# Altium schematic sheet 01_MAIN.SchDoc: =GlobalProjectName
size 594 x 420 mm; CheckedBy: A_D; Author: A_D; SheetTotal: 1; PageSetup: Record=PageOptions|CenterHorizontal=True|CenterVertical=True|PrintScale=0.70|XCorrection=1.00|YCorrection=1.00|PrintKind=2|BorderSize=5000000|LeftOffset=9000|BottomOffset=10100|Orientation=2|PaperLength=11176|PaperWidth=8636|Scale=100|PaperSource=259|PrintQuality=-3|MediaType=1|DitherType=10|PrintScaleMode=1|PaperKind=A3|PaperIndex=8
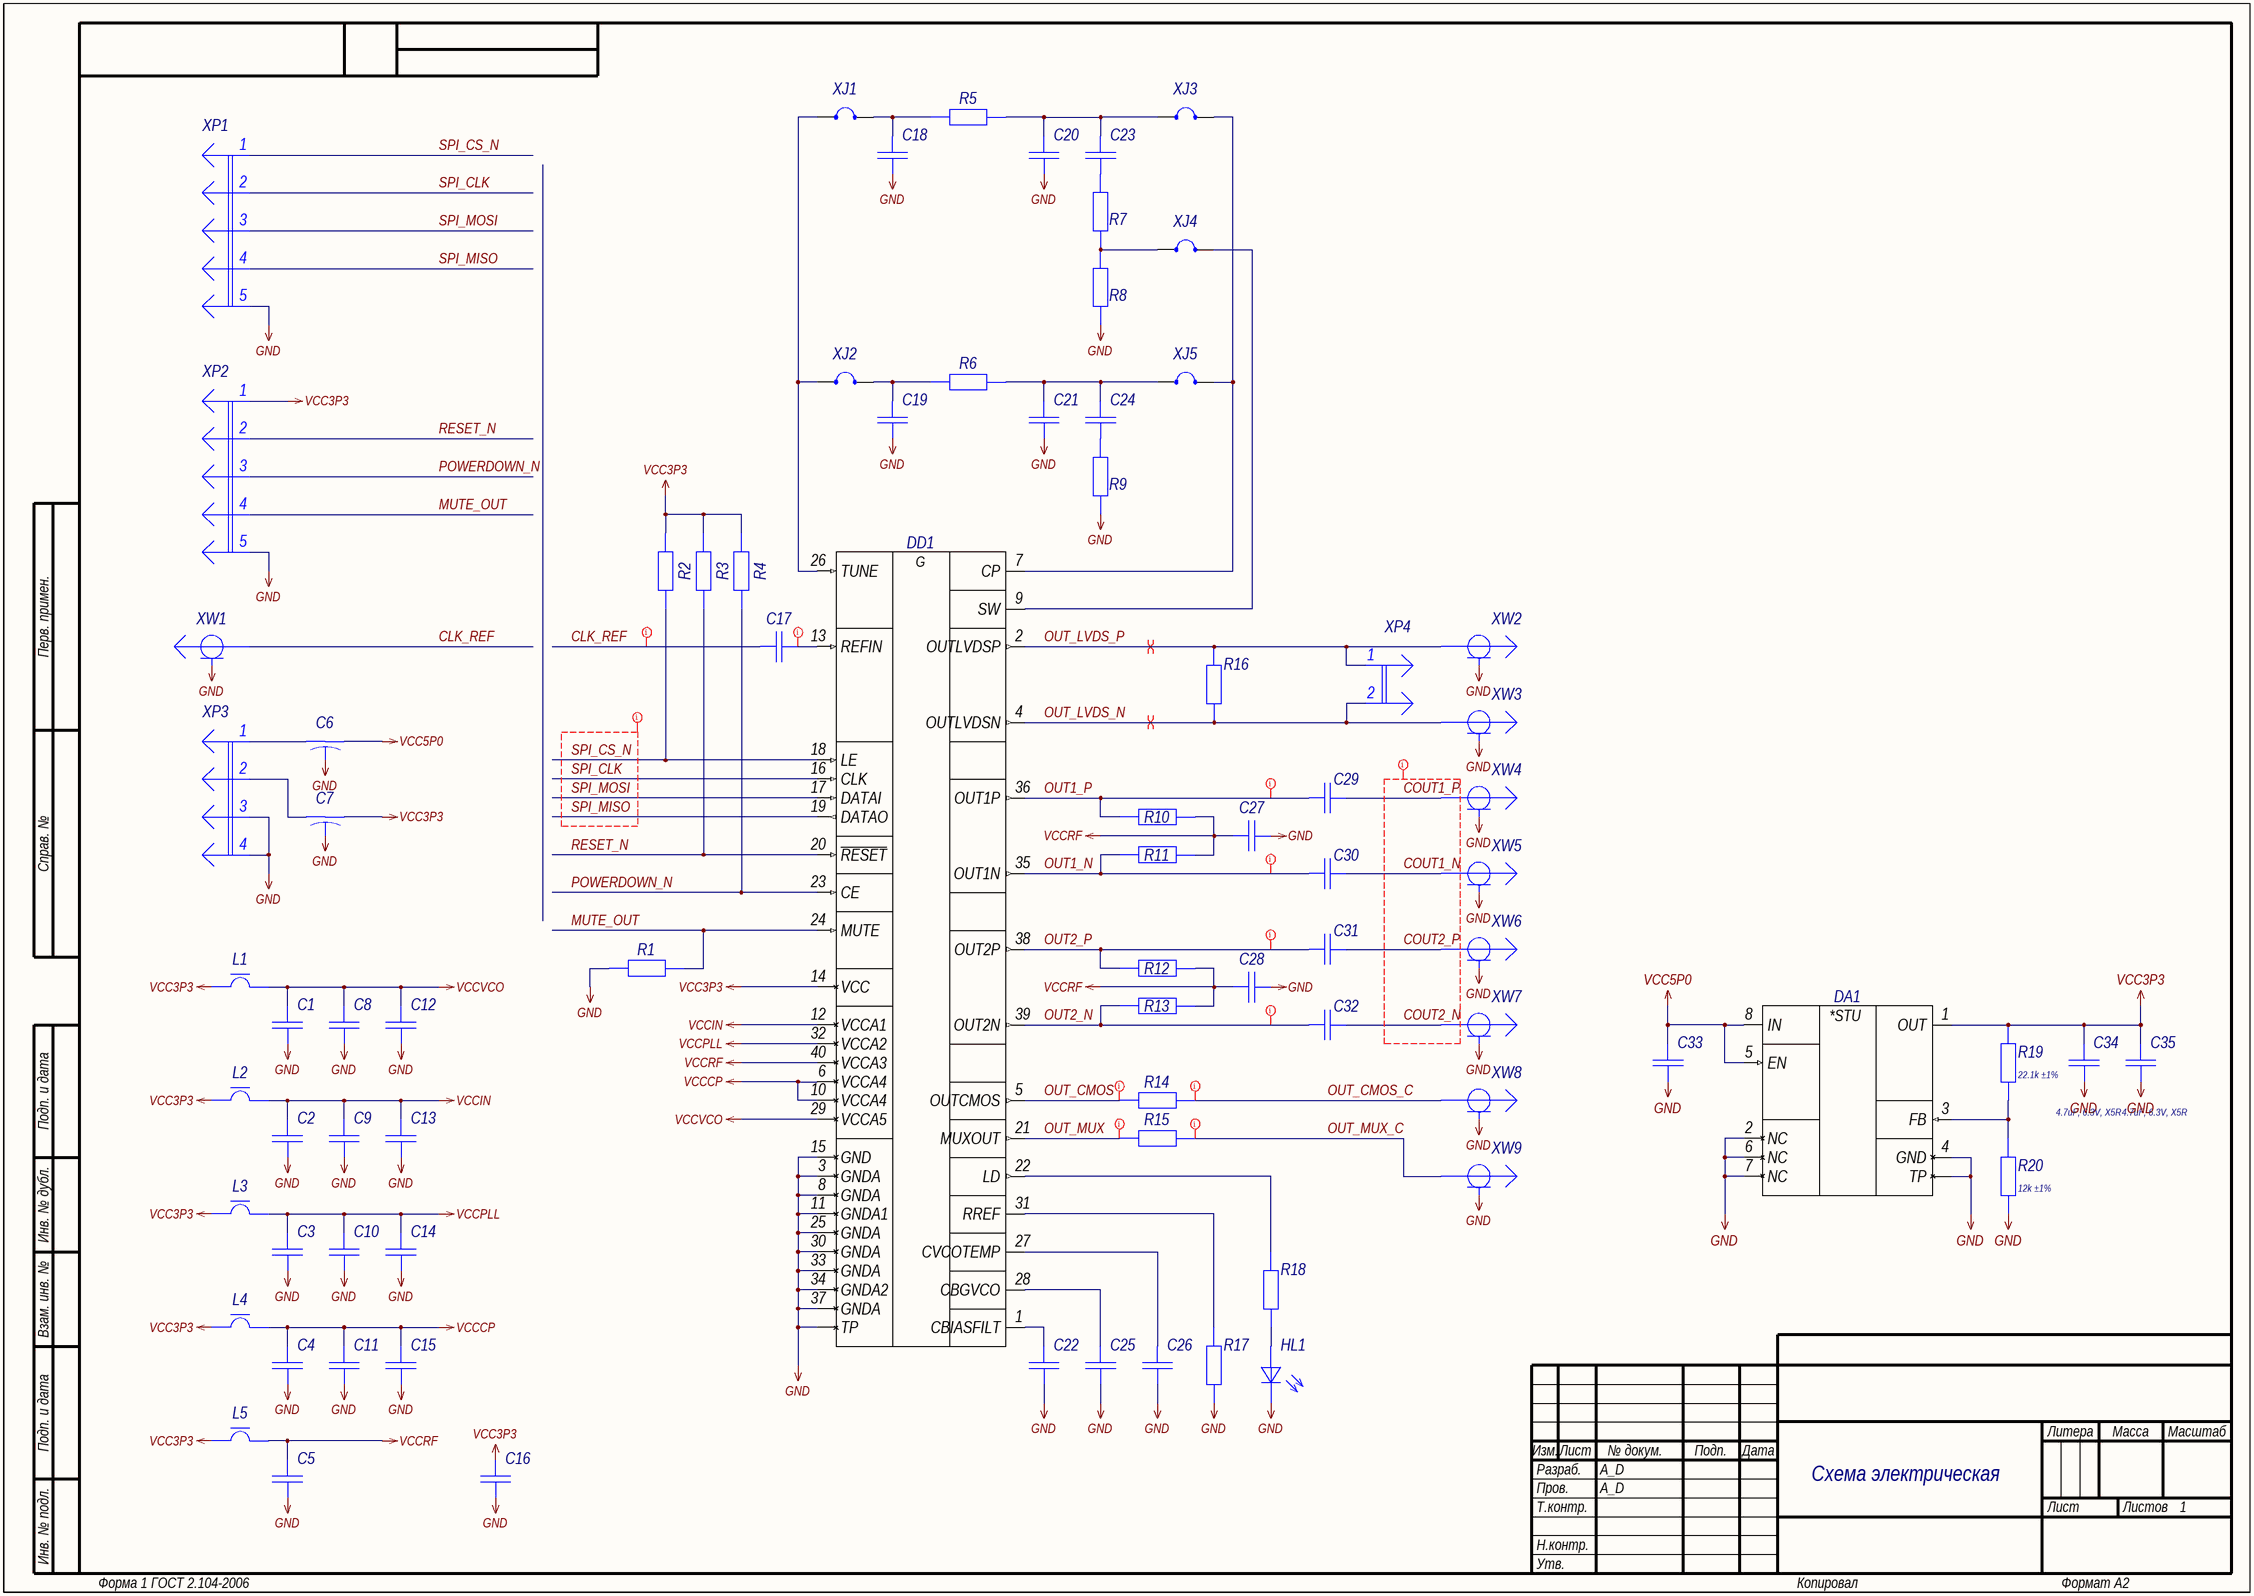
[diagram p0: 01_MAIN.SchDoc]

## Parts
C1  Capacitor  [C0402_L]  (value not drawn)
C2  Capacitor  [C0402_L]  (value not drawn)
C3  Capacitor  [C0402_L]  (value not drawn)
C4  Capacitor  [C0402_L]  (value not drawn)
C5  Capacitor  [C0402_L]  (value not drawn)
C6  CAP-FT_123  [NFM21PC]  (value not drawn)
C7  CAP-FT_123  [NFM18PC_H080-Series]  (value not drawn)
C8  Capacitor  [C0402_L]  (value not drawn)
C9  Capacitor  [C0402_L]  (value not drawn)
C10  Capacitor  [C0402_L]  (value not drawn)
C11  Capacitor  [C0402_L]  (value not drawn)
C12  Capacitor  [C0402_L]  (value not drawn)
C13  Capacitor  [C0402_L]  (value not drawn)
C14  Capacitor  [C0402_L]  (value not drawn)
C15  Capacitor  [C0402_L]  (value not drawn)
C16  Capacitor  [C0402_L]  (value not drawn)
C17  Capacitor  [C0402_L]  (value not drawn)
C18  Capacitor  [C0402_L]  (value not drawn)
C19  Capacitor  [C0402_L]  (value not drawn)
C20  Capacitor  [C0402_L]  (value not drawn)
C21  Capacitor  [C0402_L]  (value not drawn)
C22  Capacitor  [C0402_L]  (value not drawn)
C23  Capacitor  [C0402_L]  (value not drawn)
C24  Capacitor  [C0402_L]  (value not drawn)
C25  Capacitor  [C0402_L]  (value not drawn)
C26  Capacitor  [C0402_L]  (value not drawn)
C27  Capacitor  [C0402_L]  (value not drawn)
C28  Capacitor  [C0402_L]  (value not drawn)
C29  Capacitor  [C0402_L]  (value not drawn)
C30  Capacitor  [C0402_L]  (value not drawn)
C31  Capacitor  [C0402_L]  (value not drawn)
C32  Capacitor  [C0402_L]  (value not drawn)
C33  Capacitor  [C0402_L]  (value not drawn)
C34  Schematic Value: 4.7uF, 6.3V, X5R  [C0402_L]  (hidden comment: Capacitor)
C35  Schematic Value: 4.7uF, 6.3V, X5R  [C0402_L]  (hidden comment: Capacitor)
DA1  TPS73501DRB  [VSON-8_065P300X300X100_N]  (value not drawn)
DD1  1508МТ015  [5164.40-1H3]  (value not drawn)
HL1  Text  [LD0603]  (value not drawn)
L1  FerriteBead  [L0402_L]  (value not drawn)
L2  FerriteBead  [L0402_L]  (value not drawn)
L3  FerriteBead  [L0402_L]  (value not drawn)
L4  FerriteBead  [L0402_L]  (value not drawn)
L5  FerriteBead  [L0402_L]  (value not drawn)
R1  Resistor  [R0402_L]  (value not drawn)
R2  Resistor  [R0402_L]  (value not drawn)
R3  Resistor  [R0402_L]  (value not drawn)
R4  Resistor  [R0402_L]  (value not drawn)
R5  Resistor  [R0402_L]  (value not drawn)
R6  Resistor  [R0402_L]  (value not drawn)
R7  Resistor  [R0402_L]  (value not drawn)
R8  Resistor  [R0402_L]  (value not drawn)
R9  Resistor  [R0402_L]  (value not drawn)
R10  Resistor  [R0402_L]  (value not drawn)
R11  Resistor  [R0402_L]  (value not drawn)
R12  Resistor  [R0402_L]  (value not drawn)
R13  Resistor  [R0402_L]  (value not drawn)
R14  Resistor  [R0402_L]  (value not drawn)
R15  Resistor  [R0402_L]  (value not drawn)
R16  Resistor  [R0402_L]  (value not drawn)
R17  Resistor  [R0402_L]  (value not drawn)
R18  Resistor  [R0402_L]  (value not drawn)
R19  Schematic Value: 22.1k ±1%  [R0402_L]  (hidden comment: Resistor)
R20  Schematic Value: 12k ±1%  [R0402_L]  (hidden comment: Resistor)
XJ1  Text  [JS-S0603-2x]  (value not drawn)  (no BOM)
XJ2  Text  [JS-S0603-2x]  (value not drawn)  (no BOM)
XJ3  Text  [JS-S0603-2x]  (value not drawn)  (no BOM)
XJ4  Text  [JS-S0603-2x]  (value not drawn)  (no BOM)
XJ5  Text  [JS-S0603-2x]  (value not drawn)  (no BOM)
XP1  SPI  [PLS-5]  (value not drawn)
XP2  CTRL  [PLS-5]  (value not drawn)
XP3  POWER  [PLS-4]  (value not drawn)
XP4  LVDS  [PLS-2]  (value not drawn)
XW1  CLK REF  [MMCX-J-ST-TH1]  (value not drawn)
XW2  LVDS+  [MMCX-J-ST-TH1]  (value not drawn)
XW3  LVDS-  [MMCX-J-ST-TH1]  (value not drawn)
XW4  OUT1+  [MMCX-J-ST-TH1]  (value not drawn)
XW5  OUT1-  [MMCX-J-ST-TH1]  (value not drawn)
XW6  OUT2+  [MMCX-J-ST-TH1]  (value not drawn)
XW7  OUT2-  [MMCX-J-ST-TH1]  (value not drawn)
XW8  CMOS  [MMCX-J-ST-TH1]  (value not drawn)
XW9  MUX  [MMCX-J-ST-TH1]  (value not drawn)

## Nets
GND: C1.1 C2.1 C3.1 C4.1 C5.1 C6.2 C7.2 C8.1 C9.1 C10.1 C11.1 C12.1 C13.1 C14.1 C15.1 C16.1 C18.1 C19.1 C20.1 C21.1 C22.1 C25.1 C26.1 C27.1 C28.1 C33.1 C34.1 C35.1 DA1.2(NC) DA1.4(GND) DA1.6(NC) DA1.7(NC) DA1.TP DD1.3(GNDA) DD1.8(GNDA) DD1.11(GNDA1) DD1.15(GND) DD1.25(GNDA) DD1.30(GNDA) DD1.33(GNDA) DD1.34(GNDA2) DD1.37(GNDA) DD1.TP HL1.2(К) R1.2 R8.1 R9.1 R17.1 R20.1 XP1.5 XP2.5 XP3.3 XP3.4 XW1.2 XW2.2 XW3.2 XW4.2 XW5.2 XW6.2 XW7.2 XW8.2 XW9.2
VCC3P3: C7.3 C16.2 C34.2 C35.2 DA1.1(OUT) DD1.14(VCC) L1.1 L2.1 L3.1 L4.1 L5.1 R2.2 R3.2 R4.2 R19.2 XP2.1
VCC5P0: C6.3 C33.2 DA1.5(EN) DA1.8(IN)
VCCCP: C4.2 C11.2 C15.2 DD1.6(VCCA4) DD1.10(VCCA4) L4.2
VCCIN: C2.2 C9.2 C13.2 DD1.12(VCCA1) L2.2
VCCPLL: C3.2 C10.2 C14.2 DD1.32(VCCA2) L3.2
VCCRF: C5.2 C27.2 C28.2 DD1.40(VCCA3) L5.2 R10.2 R11.2 R12.2 R13.2
VCCVCO: C1.2 C8.2 C12.2 DD1.29(VCCA5) L1.2
CLK_REF: C17.2 XW1.1
COUT1_N: C30.1 XW5.1
COUT1_P: C29.1 XW4.1
COUT2_N: C32.1 XW7.1
COUT2_P: C31.1 XW6.1
MUTE_OUT: DD1.24(MUTE) R1.1 XP2.4
OUT1_N: C30.2 DD1.35(OUT1N) R11.1
OUT1_P: C29.2 DD1.36(OUT1P) R10.1
OUT2_N: C32.2 DD1.39(OUT2N) R13.1
OUT2_P: C31.2 DD1.38(OUT2P) R12.1
OUT_CMOS: DD1.5(OUTCMOS) R14.1
OUT_CMOS_C: R14.2 XW8.1
OUT_LVDS_N: DD1.4(OUTLVDSN) R16.1 XP4.2 XW3.1
OUT_LVDS_P: DD1.2(OUTLVDSP) R16.2 XP4.1 XW2.1
OUT_MUX: DD1.21(MUXOUT) R15.1
OUT_MUX_C: R15.2 XW9.1
POWERDOWN_N: DD1.23(CE) R4.1 XP2.3
RESET_N: DD1.20(~{RESET}) R3.1 XP2.2
SPI_CLK: DD1.16(CLK) XP1.2
SPI_CS_N: DD1.18(LE) R2.1 XP1.1
SPI_MISO: DD1.19(DATAO) XP1.4
SPI_MOSI: DD1.17(DATAI) XP1.3
NetC6_1: C6.1 XP3.1
NetC7_1: C7.1 XP3.2
NetC17_1: C17.1 DD1.13(REFIN)
NetC18_2: C18.2 R5.1 XJ1.2
NetC19_2: C19.2 R6.1 XJ2.2
NetC20_2: C20.2 C23.2 R5.2 XJ3.1
NetC21_2: C21.2 C24.2 R6.2 XJ5.1
NetC22_2: C22.2 DD1.1(CBIASFILT)
NetC23_1: C23.1 R7.2
NetC24_1: C24.1 R9.2
NetC25_2: C25.2 DD1.28(CBGVCO)
NetC26_2: C26.2 DD1.27(CVCOTEMP)
NetDA1_3: DA1.3(FB) R19.1 R20.2
NetDD1_7: DD1.7(CP) XJ3.2 XJ5.2
NetDD1_9: DD1.9(SW) XJ4.2
NetDD1_22: DD1.22(LD) R18.2
NetDD1_26: DD1.26(TUNE) XJ1.1 XJ2.1
NetDD1_31: DD1.31(RREF) R17.2
NetHL1_1: HL1.1(А) R18.1
NetR7_1: R7.1 R8.2 XJ4.1

## Layout directives
differential pair; differential pair class OUT: OUT_LVDS_N, OUT_LVDS_P
net class 50OHM: CLK_REF, NetC17_1, OUT1_N, OUT1_P, OUT2_N, OUT2_P, OUT_CMOS, OUT_CMOS_C, OUT_MUX, OUT_MUX_C
net class SPI: SPI_CLK, SPI_CS_N, SPI_MISO, SPI_MOSI
net class 50OHM; net class COUT: COUT1_N, COUT1_P, COUT2_N, COUT2_P

## Notes on the sheet
- Схема электрическая
  принципиальная
- Перв. примен.
- Справ. №
- Подп. и дата
- Инв. № дубл.
- Взам. инв. №
- Разраб.
- Изм.
- Лист
- № докум.
- Подп.
- Дата
- Литера
- Масса
- Масштаб
- Пров.
- Т.контр.
- Листов
- Инв. № подл.
- Н.контр.
- Утв.
- Форма 1 ГОСТ 2.104-2006
- Копировал
- Формат А2
- (in symbol 1508МТ015) G
- (in symbol TPS73501DRBR) *STU

## Library data of the parts
C1-C5 C16 C33 = GRM155C71A105KE11D: Manufacturer: Murata; Type: Конденсатор; Schematic Value: 1uF, 10V, X7S; ID: 179; Value: 1uF; Voltage: 10V; Tolerance: ±10%; Dielectric Type: X7S; Application Category: 1; Working Temperature Min: -55°С; Working Temperature Max: +125°С; Published: 18.05.2010; Publisher: Andrew Danich; Part Number: GRM155C71A105KE11D; Footprint: 0402
C6 = NFM21PC474R1C3D: Manufacturer: Murata; Type: Конденсатор; ID: 6; Value: 0.47uF; Voltage Rating DC: 16V; Tolerance: ±20%; Current Rating: 2A; Channels: 1; Working Temperature Min: -55°C; Working Temperature Max: +125°C; Functional Analog: NFM21PC474R1C3B; Published: 04.11.2018; Publisher: Viktor Klishin; Part Number: NFM21PC474R1C3D; Application Category: 1
C7 = NFM18PC105R0J3D: Manufacturer: Murata; Type: Конденсатор; ID: 4; Value: 1.0uF; Voltage Rating DC: 6.3V; Tolerance: ±20%; Current Rating: 4A; Channels: 1; Working Temperature Min: -55°C; Working Temperature Max: +125°C; Functional Analog: NFM18PC105R0J3B; Published: 04.11.2018; Publisher: Viktor Klishin; Part Number: NFM18PC105R0J3D; Application Category: 1
C8-C11 C17 C24-C26 = GCM155R71C104KA55D: Manufacturer: Murata; Type: Конденсатор; Schematic Value: 0.1uF, 16V, X7R; ID: 163; Value: 0.1uF; Voltage: 16V; Tolerance: ±10%; Dielectric Type: X7R; Application Category: 1; Working Temperature Min: -55°С; Working Temperature Max: +125°С; Functional Analog: GRM155R71C104KA88D; Published: 18.05.2010; Publisher: Andrew Danich; Part Number: GCM155R71C104KA55D; Footprint: 0402
C12 C22 C27-C32 = GCM155R71E103KA37D: Manufacturer: Murata; Type: Конденсатор; Schematic Value: 0.01uF, 25V, X7R; ID: 150; Value: 0.01uF; Voltage: 25V; Tolerance: ±10%; Dielectric Type: X7R; Application Category: 1; Working Temperature Min: -55°С; Working Temperature Max: +125°С; Functional Analog: GRM155R71E103KA01D; Published: 18.05.2010; Publisher: Andrew Danich; Part Number: GCM155R71E103KA37D; Footprint: 0402
C13-C15 = GCM1555C1H101FA16D: Manufacturer: Murata; Type: Конденсатор; Schematic Value: 100pF, 50V, NP0; ID: 164; Value: 100pF; Voltage: 50V; Tolerance: ±1%; Dielectric Type: NP0; Application Category: 1; Working Temperature Min: -55°С; Working Temperature Max: +125°С; Functional Analog: GRM1555C1H101JA01D; Published: 18.05.2010; Publisher: Andrew Danich; Part Number: GCM1555C1H101FA16D; Footprint: 0402
C18-C20 = GRM1555C1H471JA01D: Manufacturer: Murata; Type: Конденсатор; Schematic Value: 470pF, 50V, NP0; ID: 185; Value: 470pF; Voltage: 50V; Tolerance: ±5%; Dielectric Type: NP0; Application Category: 1; Working Temperature Min: -55°С; Working Temperature Max: +125°С; Published: 18.05.2010; Publisher: Andrew Danich; Part Number: GRM1555C1H471JA01D; Footprint: 0402
C21 = GRM155R71H332KA01D: Manufacturer: Murata; Type: Конденсатор; Schematic Value: 3300pF, 50V, X7R; ID: 166; Value: 3300pF; Voltage: 50V; Tolerance: ±10%; Dielectric Type: X7R; Application Category: 1; Working Temperature Min: -55°С; Working Temperature Max: +125°С; Published: 18.05.2010; Publisher: Andrew Danich; Part Number: GRM155R71H332KA01D; Footprint: 0402
C23 = GCM155R71E333KA55D: Manufacturer: Murata; Type: Конденсатор; Schematic Value: 0.033uF, 25V, X7R; ID: 182; Value: 0.033uF; Voltage: 25V; Tolerance: ±10%; Dielectric Type: X7R; Application Category: 1; Working Temperature Min: -55°С; Working Temperature Max: +125°С; Functional Analog: GRM155R71A333KA01D; Published: 18.05.2010; Publisher: Andrew Danich; Part Number: GCM155R71E333KA55D; Footprint: 0402
C34 C35 = GRM155R60J475ME87D: Manufacturer: Murata; Type: Конденсатор; ID: 223; Value: 4.7uF; Voltage: 6.3V; Tolerance: ±20%; Dielectric Type: X5R; Application Category: 1; Working Temperature Min: -55°С; Working Temperature Max: +85°С; Published: 18.05.2010; Publisher: Andrew Danich; Part Number: GRM155R60J475ME87D; Footprint: 0402; ClassName: DirectConnect
DA1 = TPS73501DRBR: Manufacturer: Texas Instruments; ID: 27; Input Voltage: +2.2…5.5V; Output Current: 500mA; Output Voltage: +1.2…5.5V; RMS Noise: 13.2uV; Application Category: 1; Working Temperature Min: -40°С; Working Temperature Max: +125°С; Functional Analog: TPS73501DRBT; Published: 25.03.2019; Publisher: Andrew Danich; Type: Микросхема; Part Number: TPS73501DRBR; Value: TPS73501DRBR; ClassName: DirectConnect
DD1 = 1508МТ015: Manufacturer: Миландр; ID: 1; Supply Operation: +3.0…3.6V; Supply Current: +320mA; Bandwidth: 6GHz; Specification: АЕНВ.431230.569 ТУ; Application Category: 5; Working Temperature Min: -60°С; Working Temperature Max: +85°С; Functional Analog: К1508МТ015; Published: 14.08.2020; Type: Микросхема; Publisher: Andrew Danich; Part Number: 1508МТ015; Value: 1508МТ015
HL1 = BL-LS0603GC: Type: Индикатор единичный; ID: 14; Forward Voltage: 2.3V; Forward Current: 30mA; Power Dissipation: 65mW; Color: Green; Leds: 1; Published: 03.12.2013; Publisher: Andrew Danich; Part Number: BL-LS0603GC; Value: BL-LS0603GC; Footprint: 0603; Application Category: 1
L1-L5 = BLM15HD102SN1D: Manufacturer: Murata; Type: Дроссель; Schematic Value: 1000ohm ±25%; ID: 7; Rated Current: 250mA; Impedance at 100Mhz: 1000ohm; Tolerance: ±25%; DC Resistance: 1.25ohm; Inductor Type: EMIFIL; Application Category: 1; Working Temperature Min: -55°С; Working Temperature Max: +125°С; Published: 14.11.2014; Publisher: Andrew Danich; Part Number: BLM15HD102SN1D; Value: BLM15HD102SN1D; Footprint: 0402
R1-R4 = RC0402JR-07100KL: Manufacturer: Yageo; Schematic Value: 100k ±5%; ID: 351; Value: 100k; Limit Voltage: 50V; Tolerance: ±5%; Temperature Coefficient: 100ppm; Total Power Dissipation: 0.1W; Series Type: Thick-Film; Application Category: 1; Working Temperature Min: -55°С; Working Temperature Max: +155°С; Published: 24.03.2010; Publisher: Andrew Danich; Type: Резистор; Part Number: RC0402JR-07100KL; Footprint: 0402
R5 R6 R8 = RC0402FR-071KL: Manufacturer: Yageo; Schematic Value: 1k ±1%; ID: 492; Value: 1k; Limit Voltage: 50V; Tolerance: ±1%; Temperature Coefficient: 100ppm; Total Power Dissipation: 0.1W; Series Type: Thick-Film; Application Category: 1; Working Temperature Min: -55°С; Working Temperature Max: +155°С; Published: 24.03.2010; Publisher: Andrew Danich; Type: Резистор; Part Number: RC0402FR-071KL; Footprint: 0402
R7 R9 = RC0402FR-07499RL: Manufacturer: Yageo; Schematic Value: 499 ±1%; ID: 549; Value: 499; Limit Voltage: 50V; Tolerance: ±1%; Temperature Coefficient: 100ppm; Total Power Dissipation: 0.1W; Series Type: Thick-Film; Application Category: 1; Working Temperature Min: -55°С; Working Temperature Max: +155°С; Published: 24.03.2010; Publisher: Andrew Danich; Type: Резистор; Part Number: RC0402FR-07499RL; Footprint: 0402
R10-R13 = RC0402FR-0749R9L: Manufacturer: Yageo; Schematic Value: 49.9 ±1%; ID: 491; Value: 49.9; Limit Voltage: 50V; Tolerance: ±1%; Temperature Coefficient: 100ppm; Total Power Dissipation: 0.1W; Series Type: Thick-Film; Application Category: 1; Working Temperature Min: -55°С; Working Temperature Max: +155°С; Published: 24.03.2010; Publisher: Andrew Danich; Type: Резистор; Part Number: RC0402FR-0749R9L; Footprint: 0402
R14-R16 = RC0402FR-07100RL: Manufacturer: Yageo; Schematic Value: 100 ±1%; ID: 457; Value: 100; Limit Voltage: 50V; Tolerance: ±1%; Temperature Coefficient: 100ppm; Total Power Dissipation: 0.1W; Series Type: Thick-Film; Application Category: 1; Working Temperature Min: -55°С; Working Temperature Max: +155°С; Published: 24.03.2010; Publisher: Andrew Danich; Type: Резистор; Part Number: RC0402FR-07100RL; Footprint: 0402
R17 = RC0402FR-075K1L: Manufacturer: Yageo; Schematic Value: 5.1k ±1%; ID: 496; Value: 5.1k; Limit Voltage: 50V; Tolerance: ±1%; Temperature Coefficient: 100ppm; Total Power Dissipation: 0.1W; Series Type: Thick-Film; Application Category: 1; Working Temperature Min: -55°С; Working Temperature Max: +155°С; Published: 24.03.2010; Publisher: Andrew Danich; Type: Резистор; Part Number: RC0402FR-075K1L; Footprint: 0402
R18 = RC0402JR-071KL: Manufacturer: Yageo; Schematic Value: 1k ±5%; ID: 3; Value: 1k; Limit Voltage: 50V; Tolerance: ±5%; Temperature Coefficient: 100ppm; Total Power Dissipation: 0.1W; Series Type: Thick-Film; Application Category: 1; Working Temperature Min: -55°С; Working Temperature Max: +155°С; Published: 24.03.2010; Publisher: Andrew Danich; Type: Резистор; Part Number: RC0402JR-071KL; Footprint: 0402
R19 = RC0402FR-0722K1L: Manufacturer: Yageo; ID: 447; Value: 22.1k; Limit Voltage: 50V; Tolerance: ±1%; Temperature Coefficient: 100ppm; Total Power Dissipation: 0.1W; Series Type: Thick-Film; Application Category: 1; Working Temperature Min: -55°С; Working Temperature Max: +155°С; Published: 24.03.2010; Publisher: Andrew Danich; Type: Резистор; Part Number: RC0402FR-0722K1L; Footprint: 0402
R20 = RC0402FR-0712KL: Manufacturer: Yageo; ID: 318; Value: 12k; Limit Voltage: 50V; Tolerance: ±1%; Temperature Coefficient: 100ppm; Total Power Dissipation: 0.1W; Series Type: Thick-Film; Application Category: 1; Working Temperature Min: -55°С; Working Temperature Max: +155°С; Published: 24.03.2010; Publisher: Andrew Danich; Type: Резистор; Part Number: RC0402FR-0712KL; Footprint: 0402
XJ1-XJ5 = SolderJumper-SMT: ID: 6; Application Type: SMT Jumper; Application Category: 1; Published: 20.08.2019; Publisher: Andrew Danich; Part Number: SolderJumper-SMT; Value: SolderJumper-SMT
XP1 XP2 = PLS-5: Value: PLS-5; ID: 4; Limit Voltage: 250V; Limit Current: 3A; Connector Type: Male; Resistance: 15momh; Surface Finish: Gold; Pitch: 2.54mm; Application Category: 1; Published: 07.03.2013; Publisher: Andrew Danich; Type: Вилка; Part Number: PLS-5; Pins: 5
XP3 = PLS-4: Value: PLS-4; ID: 3; Limit Voltage: 250V; Limit Current: 3A; Connector Type: Male; Resistance: 15momh; Surface Finish: Gold; Pitch: 2.54mm; Application Category: 1; Published: 07.03.2013; Publisher: Andrew Danich; Type: Вилка; Part Number: PLS-4; Pins: 4
XP4 = PLS-2: Value: PLS-2; ID: 1; Limit Voltage: 250V; Limit Current: 3A; Connector Type: Male; Resistance: 15momh; Surface Finish: Gold; Pitch: 2.54mm; Published: 07.03.2013; Publisher: Andrew Danich; Type: Вилка; Part Number: PLS-2; Pins: 2; Application Category: 1
XW1-XW9 = MMCX-J-H-ST-TH1: Manufacturer: Samtec; ID: 7; Limit Voltage: 170V; Connector Type: Male; Wave Resistance: 50ohm; Surface Finish: Gold; Frequency Band: 6GHz; Application Category: 1; Working Temperature Min: -65°С; Working Temperature Max: +125°С; Functional Analog: MMCX-J; Published: 19.09.2015; Publisher: НТЦ "Вектор"; Type: Вилка; Part Number: MMCX-J-H-ST-TH1; Value: MMCX-J-H-ST-TH1; Pins: 5